# Altium project MSP430_LM35.PrjPcb
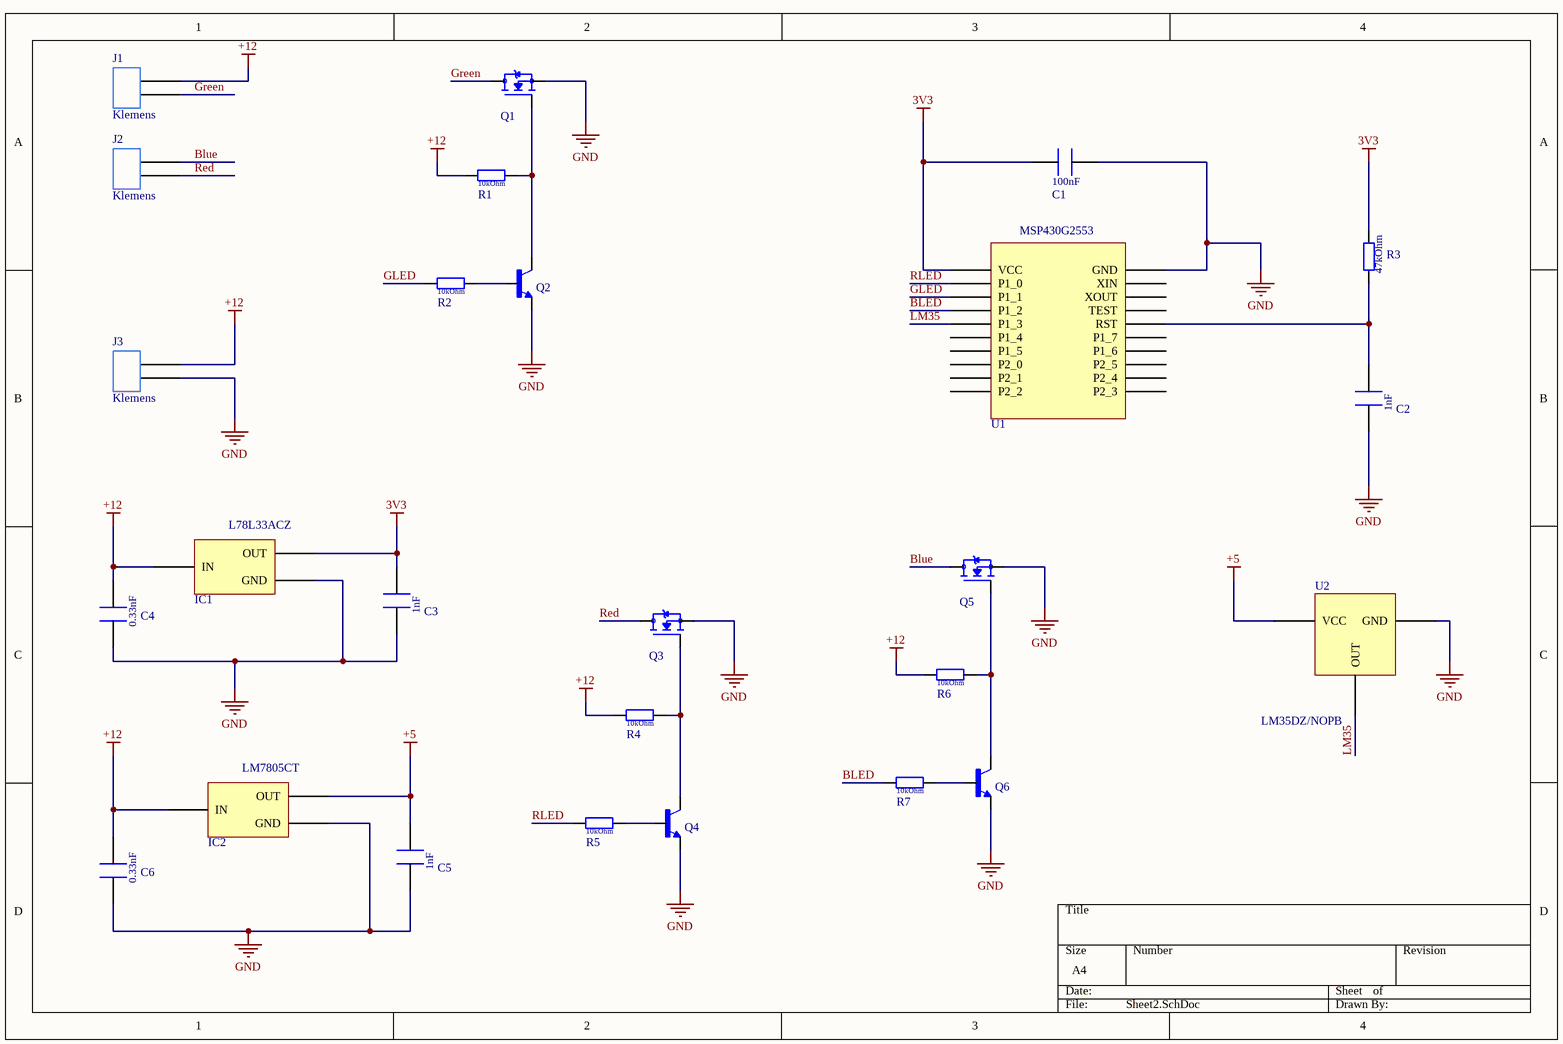
[diagram p0: Sheet2.SchDoc]
1 sheet, 26 parts. Net scope: global (net labels, ports and power ports of the same name join across sheets).
Board file: PCB1.PcbDoc

## Sheet Sheet2.SchDoc
size A4; SheetNumber: 1; SheetTotal: 1

### Parts
C1  100nF Cap  [Capacitor]  (value not drawn)
C2  1nF Cap  [Capacitor]  (value not drawn)
C3  0.1uF Cap  [Capacitor]  (value not drawn)
C4  0.33uF Cap  [Capacitor]  (value not drawn)
C5  0.1uF Cap  [Capacitor]  (value not drawn)
C6  0.33uF Cap  [Capacitor]  (value not drawn)
IC1  Manufacturer Part Number: L78L33ACZ  [L78L33]  (hidden comment: L78L Series 100 mA 3.3 V Positive Voltage Regulator Through Hole - TO-92)
IC2  Manufacturer Part Number: LM7805CT  [LM7805]  (hidden comment: LM78XX Series 5 V Fixed Output 1 A 3-Terminal LDO Voltage Regulator - TO-220)
J1  Klemens  [Klemens]
J2  Klemens  [Klemens]
J3  Klemens  [Klemens]
Q1  MOSFET, Power; N-Ch; VDSS 55V; RDS(ON) 17.5 Milliohms; ID 49A; TO-220AB; PD 94W; -55deg  [IRFZ44N]  (value not drawn)
Q2  Trans GP BJT NPN 45V 0.1A 500mW Automotive 3-Pin TO-92 Ammo  [BC547]  (value not drawn)
Q3  MOSFET, Power; N-Ch; VDSS 55V; RDS(ON) 17.5 Milliohms; ID 49A; TO-220AB; PD 94W; -55deg  [IRFZ44N]  (value not drawn)
Q4  Trans GP BJT NPN 45V 0.1A 500mW Automotive 3-Pin TO-92 Ammo  [BC547]  (value not drawn)
Q5  MOSFET, Power; N-Ch; VDSS 55V; RDS(ON) 17.5 Milliohms; ID 49A; TO-220AB; PD 94W; -55deg  [IRFZ44N]  (value not drawn)
Q6  Trans GP BJT NPN 45V 0.1A 500mW Automotive 3-Pin TO-92 Ammo  [BC547]  (value not drawn)
R1  10kOhm Res  [Res]  (value not drawn)
R2  10kOhm Res  [Res]  (value not drawn)
R3  47kOhm Res  [Res]  (value not drawn)
R4  10kOhm Res  [Res]  (value not drawn)
R5  10kOhm Res  [Res]  (value not drawn)
R6  10kOhm Res  [Res]  (value not drawn)
R7  10kOhm Res  [Res]  (value not drawn)
U1  16 MHz MCU with 16KB Flash, 512B SRAM, comparator, UART/SPI/I2C, timer 20-PDIP -40 to 85  [MSP430G2553]  (value not drawn)
U2  Manufacturer Part Number: LM35DZ/NOPB  [LM35]  (hidden comment: Temperature Sensor Analog, Local 0°C ~ 100°C 10mV/°C TO-92-3)

### Nets
3V3: C1.0 C3.1 IC1.1(OUT) R3.2 U1.0(VCC)
+5: C5.1 IC2.3(OUT) U2.1(VCC)
+12: C4.1 C6.1 IC1.3(IN) IC2.1(IN) J1.2 J3.2 R1.1 R4.1 R6.1
GND: C1.1 C2.0 C3.0 C4.0 C5.0 C6.0 IC1.2(GND) IC2.2(GND) J3.1 Q1.3(S) Q2.3(E) Q3.3(S) Q4.3(E) Q5.3(S) Q6.3(E) U1.19(GND) U2.3(GND)
BLED: R7.1 U1.3(P1_2)
Blue: J2.2 Q5.2(D)
GLED: R2.1 U1.2(P1_1)
Green: J1.1 Q1.2(D)
LM35: U1.4(P1_3) U2.2(OUT)
Red: J2.1 Q3.2(D)
RLED: R5.1 U1.1(P1_0)
NetC2_1: C2.1 R3.1 U1.15(RST)
NetQ1_1: Q1.1(G) Q2.1(C) R1.2
NetQ2_2: Q2.2(B) R2.2
NetQ3_1: Q3.1(G) Q4.1(C) R4.2
NetQ4_2: Q4.2(B) R5.2
NetQ5_1: Q5.1(G) Q6.1(C) R6.2
NetQ6_2: Q6.2(B) R7.2

Not connected (* = marked no-connect by the designer): U1 5(P1_4) 6(P1_5) 7(P2_0) 8(P2_1) 9(P2_2) 10(P2_3) 11(P2_4) 12(P2_5) 13(P1_6) 14(P1_7) 16(TEST) 17(XOUT) 18(XIN)

### Notes on the sheet
- (in symbol 0.1uF Cap) 1nF
- (in symbol 0.33uF Cap) 0.33nF
- (in symbol 1nF Cap) 1nF
- (in symbol 10kOhm Res) 10kOhm
- (in symbol 47kOhm Res) 47kOhm
- (in symbol 100nF Cap) 100nF

### Library data of the parts
IC1 = L78L33: Manufacturer: STMicroelectronics; Number of Outputs: 1; Output Voltage: 3.3V; Quiescent Current: 6mA; Max Input Voltage: 30V; Output Current: 100mA; Output Type: Fixed; Min Input Voltage: 5.3V; Dropout Voltage: 1.7V; Accuracy: 4%; Power Supply Rejection Ratio (PSRR): 49dB; Supplier 1: Mouser; RoHS: Yes; Category: Voltage Regulators - Linear; Stock 1: 19573; Pricing 1: 1=0,54, 10=0,401, 50=0,401, 100=0,271, 1000=0,168, 10000=0,142 (USD); Mount: Through Hole; Case/Package: TO-92; Number of Pins: 3; Min Operating Temperature: 0°C; Max Operating Temperature: 125°C; Packaging: Bulk; Package Quantity: 2500; Polarity: Positive; Series: -; Max Output Current: 100mA; Number of Regulators: 1; Min Output Voltage: 3.3V; Nominal Output Voltage: 3.3V; Output Configuration: Positive; Max Supply Current: 6mA; Length: 4.95mm; Width: 3.94mm; Height: 4.95mm; RoHS Compliant: Yes; Lead Free: Lead Free; Reach SVHC Compliant: No; ComponentLink1URL: https://datasheet.ciiva.com/2043/cd00000446-2043681.pdf?src-supplier=Digi-Key; ComponentLink1Description: https://datasheet.ciiva.com/2043/cd00000446-2043681.pdf?src-supplier=Digi-Key; ComponentLink2URL: https://datasheet.ciiva.com/1511/1868798-1511961.pdf?src-supplier=Element14; ComponentLink2Description: https://datasheet.ciiva.com/1511/1868798-1511961.pdf?src-supplier=Element14; ComponentLink3URL: https://datasheet.ciiva.com/16425/cd00000446-16425913.pdf?src-supplier=Future+Electronics; ComponentLink3Description: https://datasheet.ciiva.com/16425/cd00000446-16425913.pdf?src-supplier=Future+Electronics; ComponentLink4URL: https://datasheet.ciiva.com/4882/cd00000446-4882938.pdf?src-supplier=Mouser; ComponentLink4Description: https://datasheet.ciiva.com/4882/cd00000446-4882938.pdf?src-supplier=Mouser; Supplier Part Number 1: 511-L78L33ACZ
IC2 = LM7805: Manufacturer: ON Semiconductor / Fairchild; Quiescent Current: 8mA; Output Current: 1A; Output Voltage: 5V; Dropout Voltage: 2V; Max Input Voltage: 35V; Number of Outputs: 1; Polarity: Positive; Min Input Voltage: 10V; Accuracy: 4%; Max Output Current: 2.2A; Max Output Voltage: 5.2V; Supplier 1: Avnet; RoHS: Yes; Category: Voltage Regulators - Linear; Stock 1: 120242; Pricing 1: 207=1,4208, 210=1,3824, 420=1,344, 1100=1,3056, 2100=1,2672, 11000=1,2288, 21000=1,1904 (USD); Mount: Through Hole; Case/Package: TO-220; Number of Pins: 3; Weight: 1.214g; Min Operating Temperature: -40°C; Max Operating Temperature: 125°C; Packaging: Rail/Tube; Output Type: Fixed; Series: -; Number of Regulators: 1; Package Quantity: 50; Min Output Voltage: 5V; Current Rating: 1A; Nominal Output Voltage: 5V; Length: 10.67mm; Width: 4.83mm; Height: 9.4mm; RoHS Compliant: Yes; Lead Free: Lead Free; Reach SVHC Compliant: No; ComponentLink1URL: https://datasheet.ciiva.com/19456/786138-19456361.pdf?src-supplier=Jameco; ComponentLink1Description: https://datasheet.ciiva.com/19456/786138-19456361.pdf?src-supplier=Jameco; ComponentLink2URL: https://datasheet.ciiva.com/1512/1855686-1512105.pdf?src-supplier=Element14; ComponentLink2Description: https://datasheet.ciiva.com/1512/1855686-1512105.pdf?src-supplier=Element14; ComponentLink3URL: https://datasheet.ciiva.com/1512/1855686-1512106.pdf?src-supplier=Element14; ComponentLink3Description: https://datasheet.ciiva.com/1512/1855686-1512106.pdf?src-supplier=Element14; ComponentLink4URL: https://datasheet.ciiva.com/1511/1855686-1511835.pdf?src-supplier=Element14; ComponentLink4Description: https://datasheet.ciiva.com/1511/1855686-1511835.pdf?src-supplier=Element14; ComponentLink5URL: https://datasheet.ciiva.com/8239/lm7812-8239478.pdf?src-supplier=Avnet; ComponentLink5Description: https://datasheet.ciiva.com/8239/lm7812-8239478.pdf?src-supplier=Avnet; ComponentLink6URL: https://datasheet.ciiva.com/17332/lm7805-17332792.pdf?src-supplier=Future+Electronics; ComponentLink6Description: https://datasheet.ciiva.com/17332/lm7805-17332792.pdf?src-supplier=Future+Electronics; ComponentLink7URL: https://datasheet.ciiva.com/2039/lm7805-2039365.pdf?src-supplier=Digi-Key; ComponentLink7Description: https://datasheet.ciiva.com/2039/lm7805-2039365.pdf?src-supplier=Digi-Key; ComponentLink8URL: https://datasheet.ciiva.com/48694/001253095-da-01-en-ic-reg-ldo-5v-1a-lm7805ct-to-220-3-fsc-48694790.pdf?src-supplier=Conrad; ComponentLink8Description: https://datasheet.ciiva.com/48694/001253095-da-01-en-ic-reg-ldo-5v-1a-lm7805ct-to-220-3-fsc-48694790.pdf?src-supplier=Conrad; Supplier Part Number 1: LM7805CT
Q1 Q3 Q5 = IRFZ44N: Manufacturer: International Rectifier; Gate to Source Voltage (Vgs): 20V; Turn-Off Delay Time: 85ns; Turn-On Delay Time: 19ns; Rise Time: 185ns; Fall Time: 165ns; Supplier 1: Rs; Manufacturer Part Number: IRFZ44N; RoHS: No; Mount: Through Hole; Number of Pins: 3; Min Operating Temperature: -55°C; Max Operating Temperature: 175°C; Continuous Drain Current (ID): 49A; RoHS Compliant: No; Supplier Part Number 1: 3713894
Q2 Q4 Q6 = BC547B: Manufacturer: ON Semiconductor / Fairchild; Collector Emitter Saturation Voltage: 300mV; Max Collector Current: 100mA; Transition Frequency: 300MHz; Collector-emitter Voltage-Max: 600mV; hFE Min: 200; Collector Base Voltage (VCBO): 50V; Emitter Base Voltage (VEBO): 6V; Gain Bandwidth Product: 100MHz; Voltage: 40V; Supplier 1: Farnell; Manufacturer Part Number: BC547B; RoHS: Yes; Category: BJTs; Stock 1: 265589; Pricing 1: 5=0,442, 10=0,327, 100=0,188, 500=0,127, 1000=0,078, 5000=0,0764 (EUR); Mount: Through Hole; Case/Package: TO-92-3; Number of Pins: 3; Weight: 0.007055oz; Contact Plating: Copper,Tin,Silver; Min Operating Temperature: -65°C; Max Operating Temperature: 150°C; Packaging: Bulk; Polarity: NPN; Max Power Dissipation: 500mW; Collector Emitter Voltage (VCEO): 45V; Voltage Rating (DC): 45V; Current Rating: 100mA; Collector Emitter Breakdown Voltage: 45V; Series: -; Package Quantity: 5000; Max Frequency: 300MHz; Max Breakdown Voltage: 45V; Length: 4.58mm; Width: 3.86mm; Height: 4.58mm; RoHS Compliant: Yes; Lead Free: Lead Free; Reach SVHC Compliant: No; ComponentLink1URL: https://datasheet.ciiva.com/17011/bc547-17011404.pdf?src-supplier=Future+Electronics; ComponentLink1Description: https://datasheet.ciiva.com/17011/bc547-17011404.pdf?src-supplier=Future+Electronics; ComponentLink2URL: https://datasheet.ciiva.com/985/bc546-547-548rev5-985523.pdf?src-supplier=Digi-Key; ComponentLink2Description: https://datasheet.ciiva.com/985/bc546-547-548rev5-985523.pdf?src-supplier=Digi-Key; ComponentLink3URL: https://datasheet.ciiva.com/972/bc546-972262.pdf?src-supplier=Digi-Key; ComponentLink3Description: https://datasheet.ciiva.com/972/bc546-972262.pdf?src-supplier=Digi-Key; ComponentLink4URL: https://datasheet.ciiva.com/1195/1868820-1195464.pdf?src-supplier=Element14; ComponentLink4Description: https://datasheet.ciiva.com/1195/1868820-1195464.pdf?src-supplier=Element14; ComponentLink5URL: https://datasheet.ciiva.com/11197/bc550-11197769.pdf?src-supplier=Avnet; ComponentLink5Description: https://datasheet.ciiva.com/11197/bc550-11197769.pdf?src-supplier=Avnet; Supplier Part Number 1: 1017673
U1 = MSP430G2553: Manufacturer: Texas Instruments; Manufacturer Part Number: MSP430G2553IN20; Core Architecture: MSP430; Interface: I2C,SPI,IrDA,UART,USART,SCI,LIN; Number of I/Os: 16; Oscillator Type: Internal; Peripherals: Brown-out Detect/Reset,POR,PWM,WDT,DMA; Data Bus Width: 16b; Frequency: 16MHz; Number of A/D Converters: 8; Max Supply Voltage: 3.6V; Min Supply Voltage: 1.8V; Number of Timers/Counters: 2; Watchdog Timer: Yes; Number of GPIO: 24; Number of UART Channels: 1; Supplier 1: Mouser; RoHS: Yes; Category: Microcontrollers; Stock 1: 886; Pricing 1: 1=3,45, 10=3,1, 50=3,1, 100=2,54, 1000=2,4, 10000=2,4 (USD); Case/Package: N; Number of Pins: 20; Min Operating Temperature: -40°C; Max Operating Temperature: 85°C; Series: MSP430G2xx; Packaging: Rail/Tube; Package Quantity: 20; Memory Type: FLASH; Memory Size: 16KB; RAM Size: 512B; Number of ADC Channels: 8; Number of Programmable I/O: 16; Max Frequency: 16MHz; Number of SPI Channels: 2; Number of I2C Channels: 1; Length: 24.33mm; Width: 6.35mm; Height: 5.08mm; Radiation Hardening: No; Lead Free: Lead Free; Reach SVHC Compliant: No; RoHS Compliant: Yes; ComponentLink1URL: https://datasheet.ciiva.com/28657/1695238-28657971.pdf?src-supplier=Element14; ComponentLink1Description: https://datasheet.ciiva.com/28657/1695238-28657971.pdf?src-supplier=Element14; Supplier Part Number 1: 595-MSP430G2553IN20
U2 = LM35: Manufacturer: TI National Semiconductor; Min Supply Voltage: 4V; Max Supply Voltage: 30V; Quiescent Current: 56uA; Output Type: Voltage,Analog Voltage,Analog; Supplier 1: Digi-Key; RoHS: Yes; Category: Integrated Circuits (ICs); Pricing 1: 1=2,52, 5=2,382, 10=2,042, 25=1,6336, 50=1,4976, 100=1,3615, 500=1,1913, 1000=1,05515, 5000=0,98707 (USD); Mount: Through Hole; Case/Package: TO-92; Number of Pins: 3; Min Operating Temperature: -40°C; Max Operating Temperature: 110°C; Packaging: Bulk; Series: -; Interface: Analog; Output: ANALOG; Length: 5.2mm; Width: 4.19mm; Height: 5.2mm; Lead Free: Lead Free; RoHS Compliant: Yes; Reach SVHC Compliant: No; Supplier Part Number 1: LM35DZ/NOPB-ND